# EAGLE design Parallel CS V3 (EAGLE 7.2.0)

## Sheet 1 of 2: Input Layer
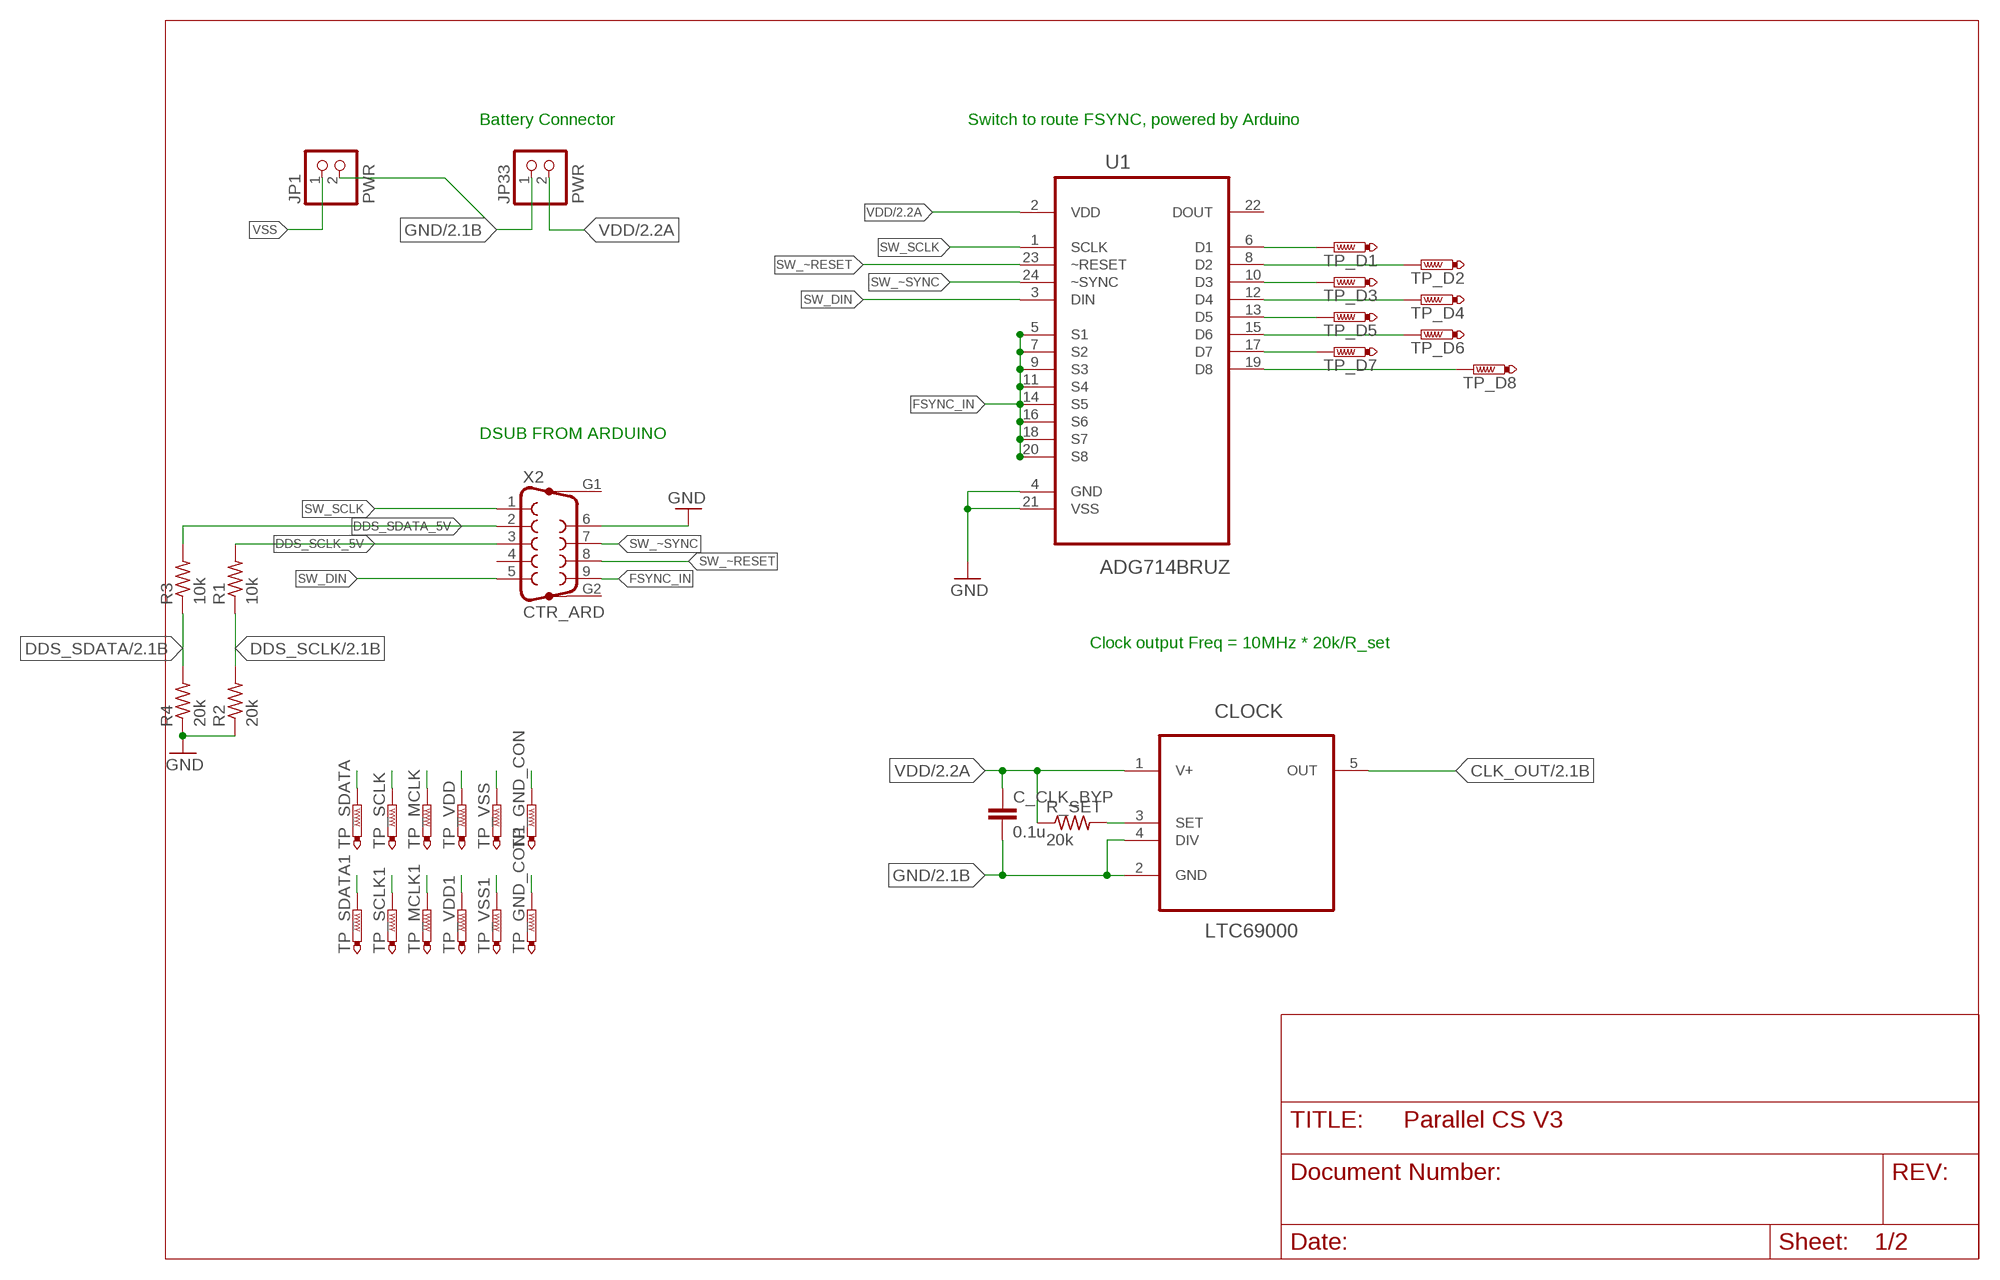
[diagram p0: schematic, sheet 1]

### Parts
C_CLK_BYP  0.1u  C-EUC0805  [C0805]
CLOCK  LTC69000  [SOT23-5L]
JP1  PWR  PINHD-1X2  [1X02]
JP33  PWR  PINHD-1X2  [1X02]
R1  10k  R-US_R0805  [R0805]
R2  20k  R-US_R0603  [R0603]
R3  10k  R-US_R0805  [R0805]
R4  20k  R-US_R0603  [R0603]
R_SET  20k  R-US_R0603  [R0603]
TP_D1  PTR1PAD1-13  [P1-13]
TP_D2  PTR1PAD1-13  [P1-13]
TP_D3  PTR1PAD1-13  [P1-13]
TP_D4  PTR1PAD1-13  [P1-13]
TP_D5  PTR1PAD1-13  [P1-13]
TP_D6  PTR1PAD1-13  [P1-13]
TP_D7  PTR1PAD1-13  [P1-13]
TP_D8  PTR1PAD1-13  [P1-13]
TP_GND_CON  PTR1PAD1-13  [P1-13]
TP_GND_CON1  PTR1PAD1-13  [P1-13]
TP_MCLK  PTR1PAD1-13  [P1-13]
TP_MCLK1  PTR1PAD1-13  [P1-13]
TP_SCLK  PTR1PAD1-13  [P1-13]
TP_SCLK1  PTR1PAD1-13  [P1-13]
TP_SDATA  PTR1PAD1-13  [P1-13]
TP_SDATA1  PTR1PAD1-13  [P1-13]
TP_VDD  PTR1PAD1-13  [P1-13]
TP_VDD1  PTR1PAD1-13  [P1-13]
TP_VSS  PTR1PAD1-13  [P1-13]
TP_VSS1  PTR1PAD1-13  [P1-13]
U1  ADG714BRUZ  [SOP65P640X120-24N]
X2  CTR_ARD  F09HP  [F09HP]

### Nets
CLK_OUT: CLOCK.5(OUT) TP_MCLK1.TP TP_MCLK.TP ; also sheet 2
DDS_SCLK: R1.1 R2.2 TP_SCLK1.TP TP_SCLK.TP ; also sheet 2
DDS_SCLK_5V: R1.2 X2.3
DDS_SDATA: R3.1 R4.2 TP_SDATA1.TP TP_SDATA.TP ; also sheet 2
DDS_SDATA_5V: R3.2 X2.2
FSYNC_CS1: TP_D1.TP U1.6(D1)
FSYNC_CS2: TP_D2.TP U1.8(D2)
FSYNC_CS3: TP_D3.TP U1.10(D3)
FSYNC_CS4: TP_D4.TP U1.12(D4)
FSYNC_CS5: TP_D5.TP U1.13(D5)
FSYNC_CS6: TP_D6.TP U1.15(D6)
FSYNC_CS7: TP_D7.TP U1.17(D7)
FSYNC_CS8: TP_D8.TP U1.19(D8)
FSYNC_IN: U1.5(S1) U1.7(S2) U1.9(S3) U1.11(S4) U1.14(S5) U1.16(S6) U1.18(S7) U1.20(S8) X2.9
GND: C_CLK_BYP.2 CLOCK.2(GND) CLOCK.4(DIV) JP1.2 JP33.1 R2.1 R4.1 TP_GND_CON1.TP TP_GND_CON.TP U1.4(GND) U1.21(VSS) X2.6 ; also sheet 2
N$2: CLOCK.3(SET) R_SET.2
SW_DIN: U1.3(DIN) X2.5
SW_SCLK: U1.1(SCLK) X2.1
SW_~RESET: U1.23(~RESET) X2.8
SW_~SYNC: U1.24(~SYNC) X2.7
VDD: C_CLK_BYP.1 CLOCK.1(V+) JP33.2 R_SET.1 TP_VDD1.TP TP_VDD.TP U1.2(VDD) ; also sheet 2
VSS: JP1.1 TP_VSS1.TP TP_VSS.TP ; also sheet 2
Unconnected: U1.22(DOUT) X2.4 X2.G1 X2.G2

### Notes on the sheet
- Battery Connector | Switch to route FSYNC, powered by Arduino
- DSUB FROM ARDUINO
- Clock output Freq = 10MHz * 20k/R_set

## Sheet 2 of 2: Current Source Block
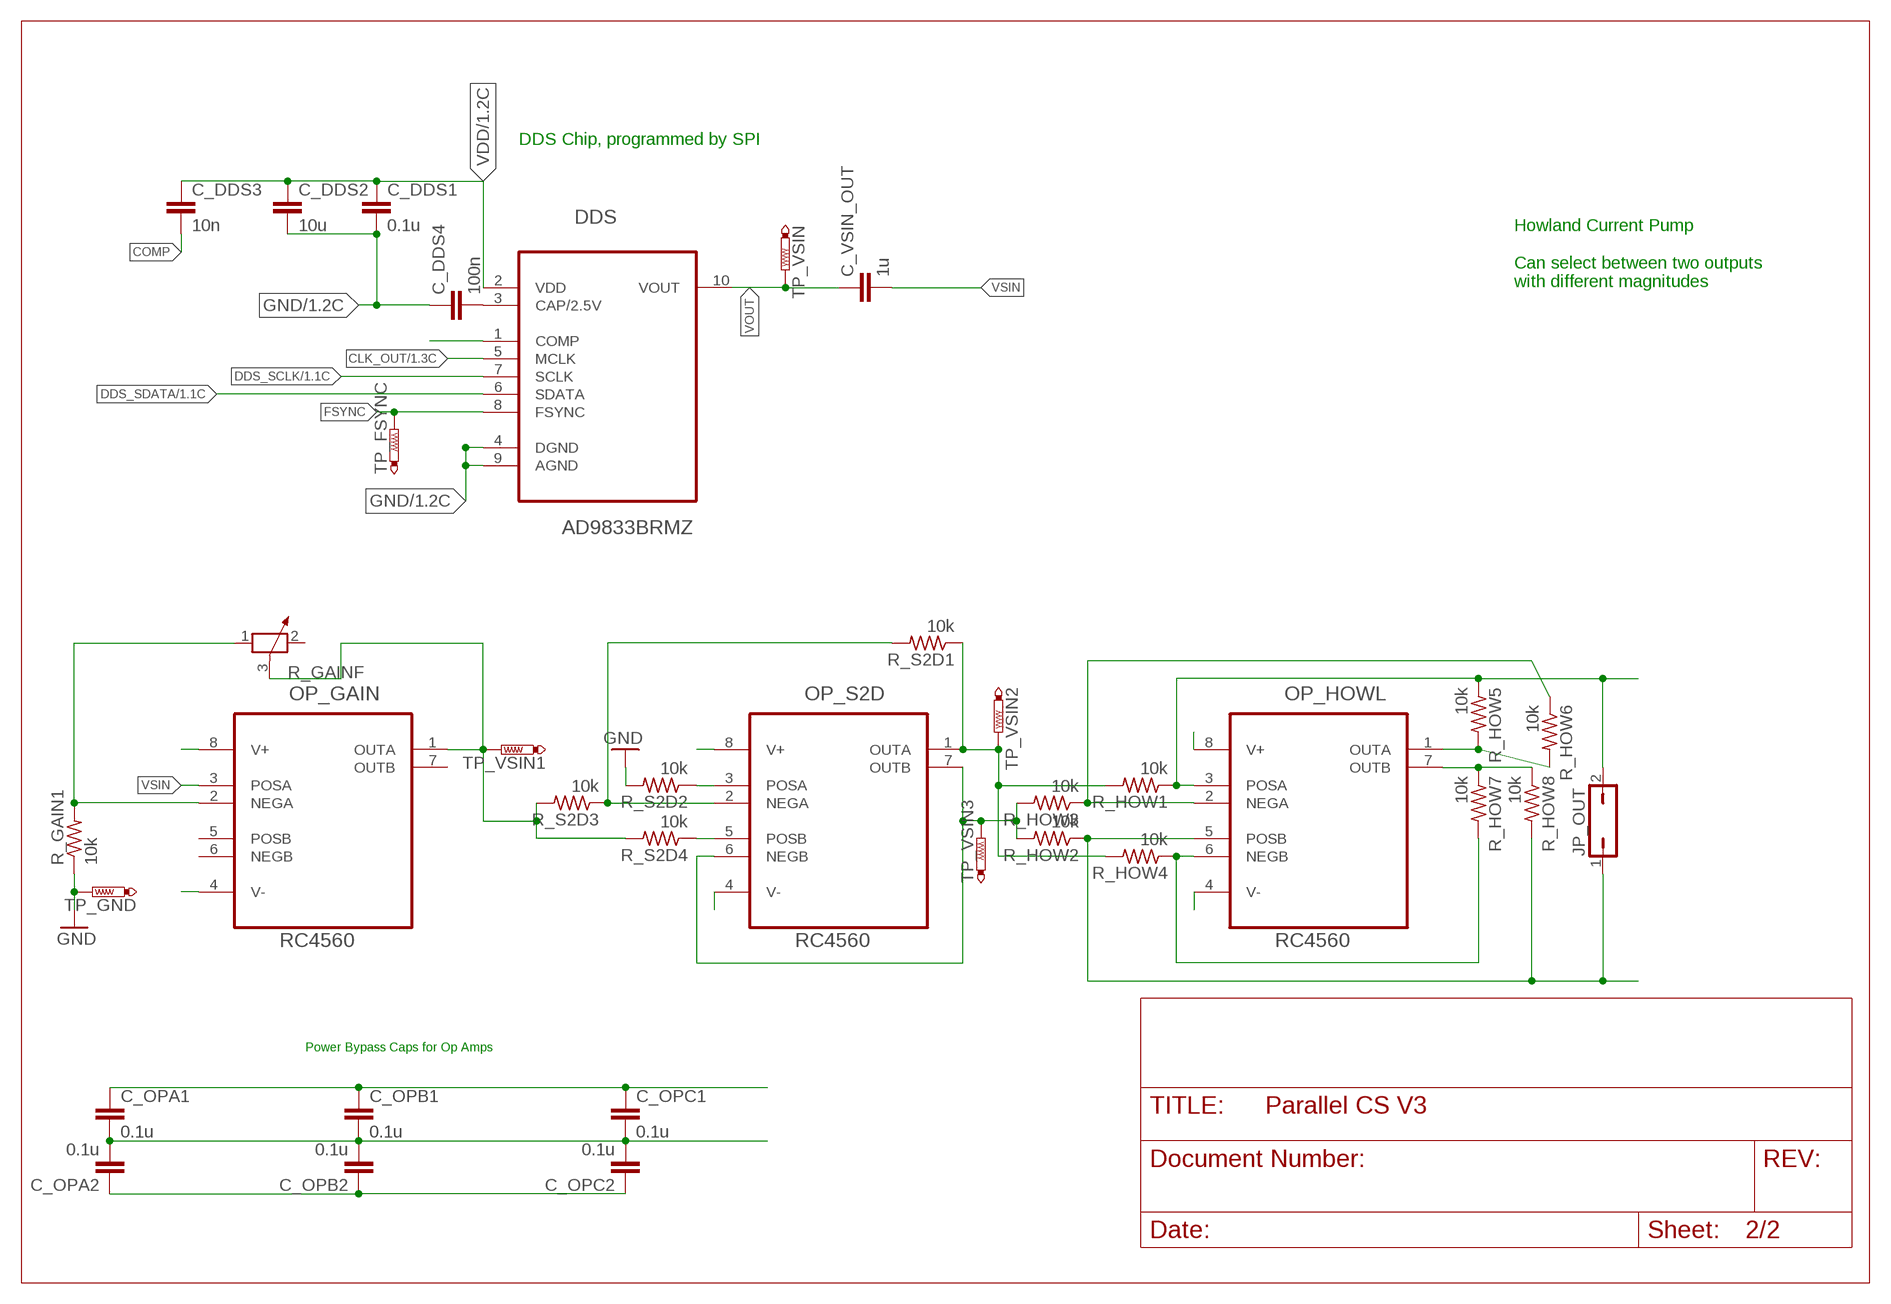
[diagram p1: schematic, sheet 2]

### Parts
C_DDS1  0.1u  C-EUC0805  [C0805]
C_DDS2  10u  C-EUC0805  [C0805]
C_DDS3  10n  C-EUC0805  [C0805]
C_DDS4  100n  C-EUC0805  [C0805]
C_OPA1  0.1u  C-EUC0805  [C0805]
C_OPA2  0.1u  C-EUC0805  [C0805]
C_OPB1  0.1u  C-EUC0805  [C0805]
C_OPB2  0.1u  C-EUC0805  [C0805]
C_OPC1  0.1u  C-EUC0805  [C0805]
C_OPC2  0.1u  C-EUC0805  [C0805]
C_VSIN_OUT  1u  C-EUC0805  [C0805]
DDS  AD9833BRMZ  [SOP50P490X110-10N]
JP_OUT  JP1Q  [JP1]
OP_GAIN  RC4560  [DIL08]
OP_HOWL  RC4560  [DIL08]
OP_S2D  RC4560  [DIL08]
R_GAIN1  10k  R-US_R0805  [R0805]
R_GAINF  POTENTIOMETER_PT-10  [PT-10]
R_HOW1  10k  R-US_R0805  [R0805]
R_HOW2  10k  R-US_R0805  [R0805]
R_HOW3  10k  R-US_R0805  [R0805]
R_HOW4  10k  R-US_R0805  [R0805]
R_HOW5  10k  R-US_R0805  [R0805]
R_HOW6  10k  R-US_R0805  [R0805]
R_HOW7  10k  R-US_R0805  [R0805]
R_HOW8  10k  R-US_R0805  [R0805]
R_S2D1  10k  R-US_R0805  [R0805]
R_S2D2  10k  R-US_R0805  [R0805]
R_S2D3  10k  R-US_R0805  [R0805]
R_S2D4  10k  R-US_R0805  [R0805]
TP_FSYNC  PTR1PAD1-13  [P1-13]
TP_GND  PTR1PAD1-13  [P1-13]
TP_VSIN  PTR1PAD1-13  [P1-13]
TP_VSIN1  PTR1PAD1-13  [P1-13]
TP_VSIN2  PTR1PAD1-13  [P1-13]
TP_VSIN3  PTR1PAD1-13  [P1-13]

### Nets
CLK_OUT: DDS.5(MCLK) ; also sheet 1
COMP: C_DDS3.2 DDS.1(COMP)
DDS_SCLK: DDS.7(SCLK) ; also sheet 1
DDS_SDATA: DDS.6(SDATA) ; also sheet 1
FSYNC: DDS.8(FSYNC) TP_FSYNC.TP
GND: C_DDS1.2 C_DDS2.2 C_DDS4.1 C_OPA1.2 C_OPA2.2 C_OPB1.2 C_OPB2.2 C_OPC1.2 C_OPC2.2 DDS.4(DGND) DDS.9(AGND) R_GAIN1.1 R_S2D2.2 TP_GND.TP ; also sheet 1
N$1: C_DDS4.2 DDS.3(CAP/2.5V)
N$3: OP_GAIN.1(OUTA) R_GAINF.3 R_S2D3.2 R_S2D4.2 TP_VSIN1.TP
N$4: OP_S2D.6(NEGB) OP_S2D.7(OUTB) R_HOW2.2 R_HOW3.2 TP_VSIN3.TP
N$5: OP_GAIN.2(NEGA) R_GAIN1.2 R_GAINF.1
N$6: OP_S2D.5(POSB) R_S2D4.1
N$8: OP_S2D.1(OUTA) R_HOW1.2 R_HOW4.2 R_S2D1.1 TP_VSIN2.TP
N$9: OP_S2D.3(POSA) R_S2D2.1
N$10: OP_S2D.2(NEGA) R_S2D1.2 R_S2D3.1
N$12: OP_HOWL.2(NEGA) R_HOW3.1 R_HOW6.1
N$13: JP_OUT.2 OP_HOWL.3(POSA) R_HOW1.1 R_HOW5.1
N$14: JP_OUT.1 OP_HOWL.5(POSB) R_HOW2.1 R_HOW8.2
N$16: OP_HOWL.1(OUTA) R_HOW5.2 R_HOW6.2
N$17: OP_HOWL.7(OUTB) R_HOW7.1 R_HOW8.1
N$20: OP_HOWL.6(NEGB) R_HOW4.1 R_HOW7.2
VDD: C_DDS1.1 C_DDS2.1 C_DDS3.1 C_OPA1.1 C_OPB1.1 C_OPC1.1 DDS.2(VDD) OP_GAIN.8(V+) OP_HOWL.8(V+) OP_S2D.8(V+) ; also sheet 1
VOUT: C_VSIN_OUT.1 DDS.10(VOUT) TP_VSIN.TP
VSIN: C_VSIN_OUT.2 OP_GAIN.3(POSA)
VSS: C_OPA2.1 C_OPB2.1 C_OPC2.1 OP_GAIN.4(V-) OP_HOWL.4(V-) OP_S2D.4(V-) ; also sheet 1
Unconnected: OP_GAIN.5(POSB) OP_GAIN.6(NEGB) OP_GAIN.7(OUTB) R_GAINF.2

### Notes on the sheet
- DDS Chip, programmed by SPI
- Howland Current Pump
  
  Can select between two outputs
  with different magnitudes
- Power Bypass Caps for Op Amps

## Library data of the parts
C_CLK_BYP C_DDS1-C_DDS4 C_OPA1 C_OPA2 C_OPB1 C_OPB2 C_OPC1 C_OPC2 C_VSIN_OUT = resistor:C-EU: CAPACITOR, European symbol
CLOCK = LTC6900:LTC69000: Low Power, 1kHz to 20MHz Resistor Set SOT-23 Oscillator
DDS = ad9833:AD9833BRMZ: Low Power 12.65 mW, 2.3 V to 5.5 V,Low Power 12.65 mW, 2.3 V to 5.5 V,Low Power 12.65 mW, 2.3 V to 5.5 V,Programmable Waveform Generator; MPN: AD9833BRMZ; OC_FARNELL: 1581966; OC_NEWARK: 19M1014; PACKAGE: MSOP-10; SUPPLIER: Analog Devices
JP1 JP33 = pinhead:PINHD-1X2: PIN HEADER
JP_OUT = jumper:JP1Q: JUMPER
OP_GAIN OP_HOWL OP_S2D = RC4560:RC4560: RC4560 Op-Amp Texas Instruments
R1-R4 R_SET = resistor:R-US_: RESISTOR, American symbol
R_GAIN1 R_HOW1-R_HOW8 R_S2D1-R_S2D4 = rcl:R-US_: RESISTOR, American symbol
R_GAINF = rcl:POTENTIOMETER_: Potentiometer
TP_D1-TP_D8 TP_FSYNC TP_GND TP_GND_CON TP_GND_CON1 TP_MCLK TP_MCLK1 TP_SCLK TP_SCLK1 TP_SDATA TP_SDATA1 TP_VDD TP_VDD1 TP_VSIN TP_VSIN1-TP_VSIN3 TP_VSS TP_VSS1 = testpad:PTR1: TEST PIN
U1 = SwitchBoard:ADG714BRUZ: CMOS, Low Voltage Serially Controlled, Octal SPST Switches; MPN: ADG714BRUZ; OC_FARNELL: 9604367; OC_NEWARK: 59K1531; PACKAGE: TSSOP-24; SUPPLIER: Analog Devices
X2 = con-subd:F09HP: SUB-D; OC_FARNELL: unknown; OC_NEWARK: unknown

## Board
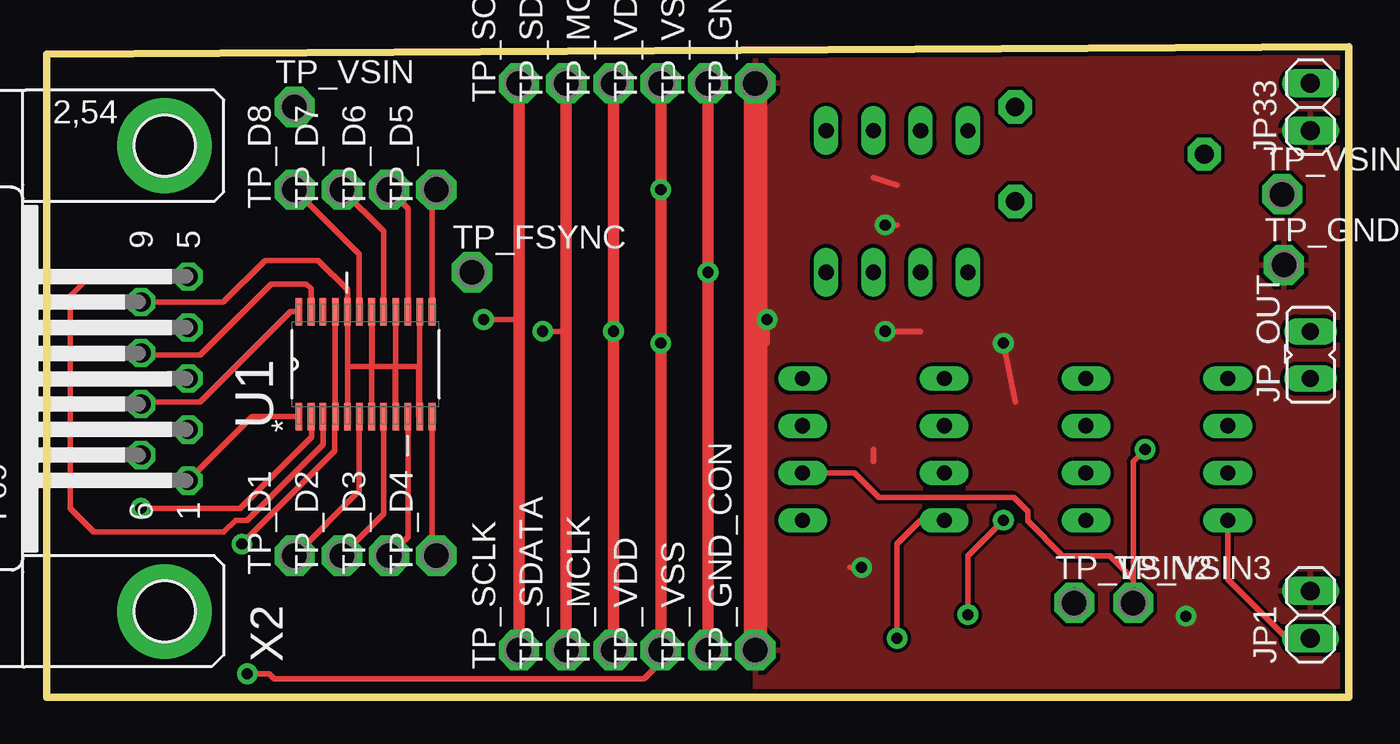
[diagram p2: board, top side]
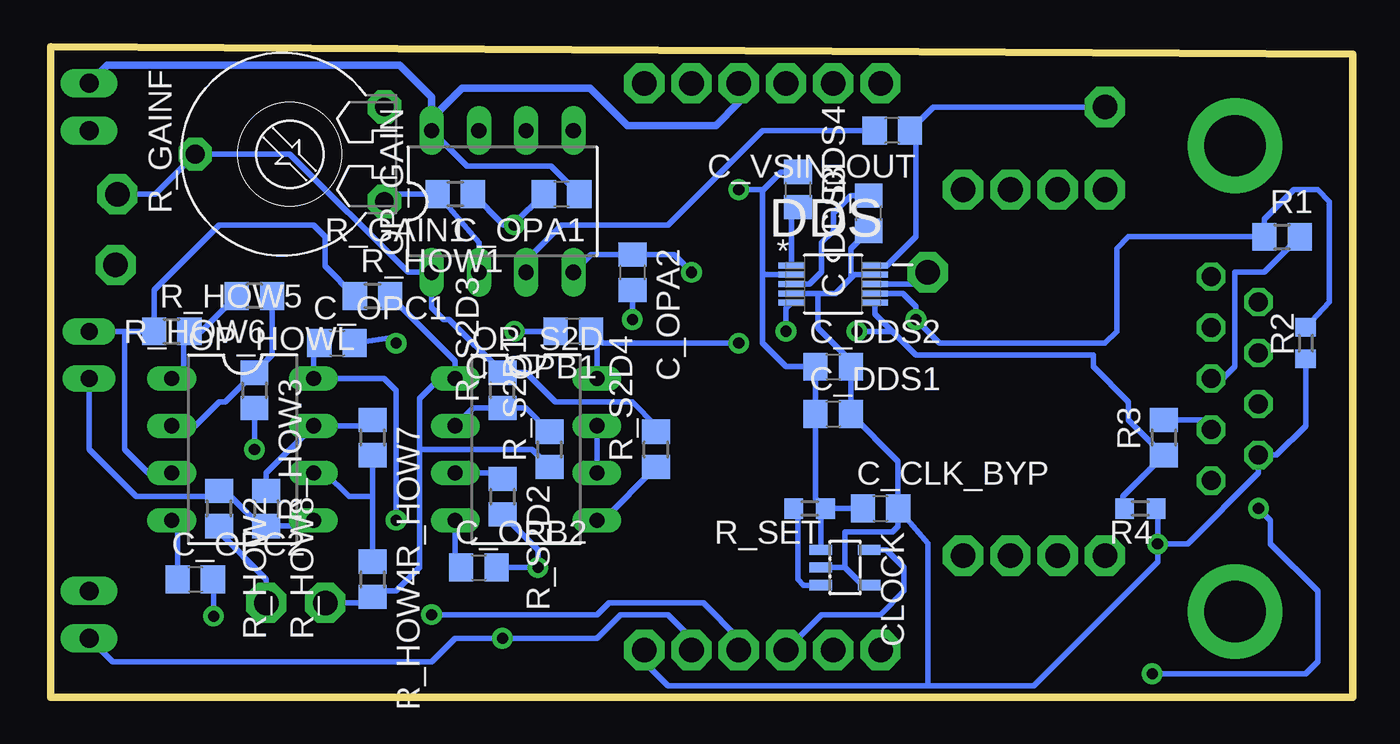
[diagram p3: board, bottom side, seen from below]

Size 70 x 35 mm. Coordinates in mm from the lower left corner, seen from the top.
Outline: 0,0 70,0 70,35 0,34.59 0,0
Copper layers (1*16): Top 0.035mm / dielectric 1.5mm / Bottom 0.035mm
Design rules "pcbtrain": minimum track width 0.2mm, minimum drill 0.4mm, track to track 0.2mm, track to pad 0.2mm, pad to pad 0.2mm, via to via 0.2mm, smd to smd 0mil, copper to edge 10mil, drill to drill 0.2mm, minimum pad ring 10mil, minimum via ring 10mil, stop-mask expansion 0.125mm, vias tented up to drill 0mil, thermal gap 10mil

### Footprints (pad centres in the part's own frame; a part is rotated, then mirrored left to right if it is on the bottom)
C0805 = smd 1.3 x 1.5: 1 -0.95,0; 2 0.95,0
SOT23-5L = smd 0.55 x 1.2: 1 -0.95,-1.3; 2 0,-1.3; 3 0.95,-1.3; 4 0.95,1.3; 5 -0.95,1.3
SOP50P490X110-10N = smd 1.422 x 0.305: 1 -2.235,0.991; 2 -2.235,0.508; 3 -2.235,0; 4 -2.235,-0.508; 5 -2.235,-0.991; 6 2.235,-0.991; 7 2.235,-0.508; 8 2.235,0; 9 2.235,0.508; 10 2.235,0.991
1X02 = drill 1.016 long: 1 -1.27,0; 2 1.27,0
JP1 = drill 0.914 long: 1 0,-1.27; 2 0,1.27
DIL08 = drill 0.813 long: 1 -3.81,-3.81; 2 -1.27,-3.81; 3 1.27,-3.81; 4 3.81,-3.81; 5 3.81,3.81; 6 1.27,3.81; 7 -1.27,3.81; 8 -3.81,3.81
R0805 = smd 1.3 x 1.5: 1 -0.95,0; 2 0.95,0
R0603 = smd 1 x 1.1: 1 -0.85,0; 2 0.85,0
PT-10 = drill 1.016 pad 1.778 octagon: 1 -2.54,-5.08; 2 2.54,-5.08; 3 0,5.08
P1-13 = drill 1.321 pad 2.159 octagon: TP 0,0
SOP65P640X120-24N = smd 1.473 x 0.356: 1 -2.819,3.581; 2 -2.819,2.921; 3 -2.819,2.286; 4 -2.819,1.626; 5 -2.819,0.965; 6 -2.819,0.33; 7 -2.819,-0.33; 8 -2.819,-0.965; 9 -2.819,-1.626; 10 -2.819,-2.286; 11 -2.819,-2.921; 12 -2.819,-3.581; 13 2.819,-3.581; 14 2.819,-2.921; 15 2.819,-2.286; 16 2.819,-1.626; 17 2.819,-0.965; 18 2.819,-0.33; 19 2.819,0.33; 20 2.819,0.965; 21 2.819,1.626; 22 2.819,2.286; 23 2.819,2.921; 24 2.819,3.581
F09HP = drill 1.016 octagon: 1 -5.486,-1.27; 2 -2.743,-1.27; 3 0,-1.27; 4 2.743,-1.27; 5 5.486,-1.27; 6 -4.115,1.27; 7 -1.372,1.27; 8 1.372,1.27; 9 4.115,1.27 | drill 3.302 pad 5.08: G1 -12.522,0; G2 12.522,0

### Placement (x,y rotation side)
C_CLK_BYP  25.4,10.16 0 bottom
C_DDS1  27.94,15.24 0 bottom
C_DDS2  27.94,17.78 0 bottom
C_DDS3  29.84,27.3 270 bottom
C_DDS4  26.04,26.04 90 bottom
C_OPA1  42.55,27.05 180 bottom
C_OPA2  38.73,22.86 270 bottom
C_OPB1  41.91,19.68 180 bottom
C_OPB2  46.99,6.99 0 bottom
C_OPC1  54.61,19.05 0 bottom
C_OPC2  62.23,6.35 0 bottom
C_VSIN_OUT  24.77,30.48 180 bottom
CLOCK  27.3,6.99 270 bottom
DDS  27.94,22.23 0 bottom
JP1  67.94,4.45 90 top
JP33  67.94,31.75 90 top
JP_OUT  67.94,18.41 0 top
OP_GAIN  45.72,26.67 0 bottom
OP_HOWL  59.69,13.34 270 bottom
OP_S2D  44.45,13.34 270 bottom
R1  3.81,24.77 0 bottom
R2  2.54,19.05 90 bottom
R3  10.16,13.97 90 bottom
R4  11.43,10.16 180 bottom
R_GAIN1  48.26,27.05 180 bottom
R_GAINF  57.15,29.21 90 bottom
R_HOW1  52.7,21.59 0 bottom
R_HOW2  60.96,10.16 270 bottom
R_HOW3  59.05,16.51 270 bottom
R_HOW4  52.7,6.35 270 bottom
R_HOW5  63.5,19.68 0 bottom
R_HOW6  59.05,21.59 180 bottom
R_HOW7  52.7,13.97 270 bottom
R_HOW8  58.42,10.16 270 bottom
R_S2D1  43.18,13.34 90 bottom
R_S2D2  45.72,10.79 270 bottom
R_S2D3  45.72,16.51 90 bottom
R_S2D4  37.47,13.34 90 bottom
R_SET  29.21,10.16 180 bottom
TP_D1  13.34,7.62 90 top
TP_D2  15.88,7.62 90 top
TP_D3  18.41,7.62 90 top
TP_D4  20.95,7.62 90 top
TP_D5  20.95,27.3 90 top
TP_D6  18.41,27.3 90 top
TP_D7  15.88,27.3 90 top
TP_D8  13.34,27.3 90 top
TP_FSYNC  22.86,22.86 0 top
TP_GND  66.52,23.25 0 top
TP_GND_CON  38.1,2.54 90 top
TP_GND_CON1  38.1,33.02 90 top
TP_MCLK  30.48,2.54 90 top
TP_MCLK1  30.48,33.02 90 top
TP_SCLK  25.4,2.54 90 top
TP_SCLK1  25.4,33.02 90 top
TP_SDATA  27.94,2.54 90 top
TP_SDATA1  27.94,33.02 90 top
TP_VDD  33.02,2.54 90 top
TP_VDD1  33.02,33.02 90 top
TP_VSIN  13.34,31.75 0 top
TP_VSIN1  66.42,27.05 0 top
TP_VSIN2  55.24,5.08 0 top
TP_VSIN3  58.42,5.08 0 top
TP_VSS  35.56,2.54 90 top
TP_VSS1  35.56,33.02 90 top
U1  17.14,17.91 90 top
X2  6.35,17.14 90 top

### Tracks (layer width: path | path; a pad name or v marks a point on that pad's centre or on a via)
CLK_OUT  (via drill 0.6)
  Top 0.61: TP_MCLK1.TP v30.48,19.68 TP_MCLK.TP
  Bottom 0.305: DDS.5 30.48,20.93 v30.48,19.68 | TP_MCLK.TP 28.57,4.45 25.4,4.45 24.13,5.71 24.13,6.99 25.08,7.93 CLOCK.5
COMP
  Bottom 0.305: C_DDS3.2 30.18,26.02 DDS.1
DDS_SCLK  (via drill 0.6)
  Top 0.305: v23.5,20.32 25.4,20.32
  Top 0.61: TP_SCLK1.TP 25.4,20.32 TP_SCLK.TP
  Bottom 0.305: DDS.7 24.2,21.72 23.5,21.01 v23.5,20.32 22.23,19.05 13.34,19.05 12.7,19.68 12.7,24.13 12.06,24.77 R1.1 4.76,25.72 3.17,27.3 1.91,27.3 1.27,26.67 1.27,21.27 R2.2
DDS_SCLK_5V
  Bottom 0.305: R1.2 4.76,22.86 6.35,22.86 6.35,17.78 6.99,17.14 X2.3
DDS_SDATA  (via drill 0.6)
  Top 0.305: v26.67,19.68 27.94,19.68
  Top 0.61: TP_SDATA.TP 27.94,19.68 TP_SDATA1.TP
  Bottom 0.305: 24.77,19.68 v26.67,19.68 | 24.77,19.68 25.7,20.62 DDS.6 | R4.2 12.38,10.8 R3.1 12.06,14.93 12.06,15.88 13.97,17.78 13.97,18.41 23.5,18.41 24.77,19.68
DDS_SDATA_5V
  Bottom 0.305: 9.64,14.4 R3.2 8.14,14.92 X2.2
FSYNC
  Bottom 0.305: TP_FSYNC.TP 23.5,22.23 DDS.8
FSYNC_CS1
  Top 0.305: TP_D1.TP 16.82,11.1 U1.6
FSYNC_CS2
  Top 0.305: TP_D2.TP 18.11,9.86 U1.8
FSYNC_CS3
  Top 0.305: TP_D3.TP 19.43,8.64 U1.10
FSYNC_CS4
  Top 0.305: TP_D4.TP 20.73,7.85 U1.12
FSYNC_CS5
  Top 0.305: TP_D5.TP 20.73,27.08 U1.13
FSYNC_CS6
  Top 0.305: TP_D6.TP 19.43,26.29 U1.15
FSYNC_CS7
  Top 0.305: TP_D7.TP 18.11,25.07 U1.17
FSYNC_CS8
  Top 0.305: TP_D8.TP 16.82,23.82 U1.19
FSYNC_IN
  Top 0.305: X2.9 9.5,21.25 11.74,23.5 14.61,23.5 16.18,21.92 U1.20 16.18,17.78 | U1.5 16.18,17.78 | U1.7 U1.18 17.5,20.71 17.5,17.78 | U1.16 U1.9 18.75,15.12 18.75,17.78 | U1.14 U1.11 20,15.16 20,17.75 19.97,17.78 18.75,17.78 | 18.75,17.78 17.5,17.78 | 17.5,17.78 16.18,17.78
GND  (via drill 0.6)
  Top 0.305: U1.21 U1.4 15.5,15.08 15.5,13.25 v10.5,8.25 | v38.73,20.32 38.73,19.05 | 45.72,27.55 44.45,27.94 | v45.09,25.4 45.72,25.4 | 44.45,12.7 44.45,13.34 | v45.09,19.68 46.99,19.68 | v43.81,6.99 43.18,6.99 | v51.44,19.05 52.07,15.88 | v61.25,4.37 61.25,4.25
  Top 1.27: TP_GND_CON.TP TP_GND_CON1.TP
  Bottom 0.305: v10.5,8.25 v10.5,8.26 8.89,8.26 5.08,12.06 X2.6 4.12,13.03 2.54,14.61 R2.1 | 26.99,22.54 26.8,22.73 DDS.9 | 26.99,22.54 27.81,21.72 28.75,21.72 | 28.75,21.72 DDS.4 | 22.86,0.64 36.83,0.64 38.1,1.91 TP_GND_CON.TP | 22.86,0.64 17.14,0.64 10.5,7.28 v10.5,8.25 | C_DDS4.1 26.99,24.13 26.99,22.54 | CLOCK.2 27.3,6.99 | 27.3,6.99 26.36,6.04 CLOCK.4 | 27.3,6.99 27.3,8.89 24.77,8.89 24.45,9.21 C_CLK_BYP.2 | C_CLK_BYP.2 22.86,8.27 22.86,0.64 | 28.75,21.72 28.75,19.86 27.3,18.41 27.3,17.78 C_DDS2.2 C_DDS1.2 24.45,12.7 C_CLK_BYP.2 | C_OPA2.2 v38.73,20.32 | C_OPA1.2 45.09,25.46 v45.09,25.4 45.66,25.4 R_GAIN1.1 | R4.1 10.5,10.14 v10.5,8.25 | C_OPB1.2 v45.09,19.68 | 45.72,7.3 C_OPB2.2 v43.81,6.99 43.81,7.94 R_S2D2.2 | C_OPC1.2 51.44,19.36 v51.44,19.05 | C_OPC2.2 61.25,6.32 v61.25,4.37
  pour Top: 38.1,35.56 71.75,36.2 71.75,-0.64 38.1,-1.27
N$1
  Bottom 0.305: DDS.3 29.21,22.23 28.57,22.86 28.57,24.45 27.94,25.08 27.94,26.04 26.99,26.98 C_DDS4.2
N$2
  Bottom 0.305: R_SET.2 29.84,9.95 29.84,6.35 29.53,6.04 CLOCK.3
N$3
  Bottom 0.305: OP_GAIN.1 50.8,22.86 57.15,29.21 R_GAINF.3 64.39,27.05 TP_VSIN1.TP | 49.53,22.54 OP_GAIN.1 | R_S2D4.2 37.47,14.61 38.73,15.88 42.87,15.88 44.45,17.46 R_S2D3.2 48.58,20.32 48.9,20.32 49.53,20.95 OP_GAIN.1
N$4  (via drill 0.6)
  Top 0.305: OP_S2D.6 43.44,12.06 44.75,10.75 52,10.75 52.75,10 52.75,9.48 54.61,7.62 57.15,7.62 58.42,6.35 | 58.42,6.35 58.42,5.71 TP_VSIN3.TP | v59.05,13.34 58.42,12.7 58.42,6.35
  Bottom 0.305: OP_S2D.6 OP_S2D.7 | R_HOW2.2 60.96,8.89 58.42,6.35 TP_VSIN3.TP | R_HOW3.2 v59.05,13.34
N$5
  Bottom 0.305: OP_GAIN.2 46.99,24.45 R_GAIN1.2 51.69,27.05 R_GAINF.1
N$6
  Bottom 0.305: R_S2D4.1 40.33,9.53 OP_S2D.5
N$8
  Bottom 0.305: R_S2D1.1 44.13,13.34 50.16,13.34 | R_HOW1.2 48.26,18.09 OP_S2D.1 49.1,17.14 50.16,16.09 50.16,13.34 | 50.16,13.34 50.16,6.99 51.44,5.71 52.39,5.71 R_HOW4.2 53.02,5.08 TP_VSIN2.TP
N$9
  Bottom 0.305: R_S2D2.1 46.04,12.06 OP_S2D.3
N$10
  Bottom 0.305: OP_S2D.2 47.3,15.56 R_S2D3.1 44.45,15.56 R_S2D1.2
N$12
  Bottom 0.305: OP_HOWL.2 62.23,14.61 60.96,15.88 60.64,15.88 R_HOW3.1 58.1,18.41 R_HOW6.1
N$13
  Bottom 0.305: 66.04,19.68 JP_OUT.2 | OP_HOWL.3 64.77,12.06 66.04,13.34 66.04,19.68 | 66.04,19.68 R_HOW5.1 64.45,21.91 60.96,25.4 55.88,25.4 55.24,24.77 55.24,23.18 R_HOW1.1
N$14
  Bottom 0.305: OP_HOWL.5 56.2,9.21 R_HOW8.2 58.73,9.53 59.05,9.53 60.64,11.11 R_HOW2.1 61.27,10.79 65.41,10.79 67.94,13.34 JP_OUT.1
N$16
  Bottom 0.305: OP_HOWL.1 62.87,17.14 62.87,19.37 R_HOW5.2 61.91,19.68 R_HOW6.2
N$17
  Bottom 0.305: R_HOW7.1 53.02,14.61 OP_HOWL.7 58.42,12.06 R_HOW8.1
N$20
  Bottom 0.305: R_HOW4.1 52.7,10.79 | 52.7,10.79 R_HOW7.2 | 52.7,10.79 53.98,10.79 55.24,12.06 OP_HOWL.6
SW_DIN
  Top 0.305: X2.5 7.39,22.86 2.54,22.86 1.27,21.59 1.27,10.16 2.54,8.89 9.53,8.89 10.16,9.53 10.79,9.53 14.86,13.59 U1.3
SW_SCLK
  Top 0.305: X2.1 11.06,15.1 U1.1
SW_~RESET
  Top 0.305: X2.8 5.18,18.41 8.26,18.41 12.06,22.23 13.97,22.23 14.22,21.97 U1.23
SW_~SYNC
  Top 0.305: X2.7 5.18,15.88 8.26,15.88 13.11,20.73 U1.24
VDD  (via drill 0.6)
  Top 0.305: v5.08,10.16 10.41,10.16 14.25,14 14.25,14.45 14.22,14.47 U1.2 | TP_VDD.TP 33.02,1.91 32.12,1 12.25,1 11.98,1.27 v10.79,1.27 | v51.44,9.53 49.53,7.62 v49.53,4.45
  Top 0.61: TP_VDD1.TP v33.02,27.3 v33.02,19.05 33.02,1.91
  Bottom 0.305: C_DDS3.1 30.75,28.25 31.75,27.25 | 31.75,22.86 31.75,19.05 30.48,17.78 C_DDS2.1 C_DDS1.1 28.89,10.69 R_SET.1 | 31.75,22.86 31.75,27.25 | C_CLK_BYP.1 R_SET.1 | R_SET.1 28.61,9.91 CLOCK.1 | 31.75,27.25 31.8,27.3 v33.02,27.3 | OP_GAIN.8 47.62,28.57 43.12,28.57 C_OPA1.1 | 31.75,22.86 31.62,22.73 DDS.2 | v5.08,10.16 4.45,9.53 4.45,8.26 1.91,5.71 1.91,1.91 2.54,1.27 v10.79,1.27 | 40.96,19.37 C_OPB1.1 | C_OPB1.1 40.64,19.36 OP_S2D.8 | v51.44,9.53 51.44,16.51 52.07,17.14 53.98,17.14 54.61,17.14 OP_HOWL.8 55.88,18.73 C_OPC1.1 | C_OPB1.1 40.33,19.05 v33.02,19.05 | TP_VDD.TP 33.02,3.17 34.92,5.08 40.01,5.08 40.64,4.45 v49.53,4.45
  Bottom 0.406: JP33.2 66.97,34 51.25,34 49.53,32.28 OP_GAIN.8 49.53,31.11 47.9,32.75 41,32.75 39,30.75 34.25,30.75 33.02,31.98 TP_VDD1.TP
VOUT
  Bottom 0.305: DDS.10 25.04,23.22 23.5,24.77 23.5,30.16 C_VSIN_OUT.1 22.55,31.75 TP_VSIN.TP
VSIN
  Bottom 0.305: C_VSIN_OUT.2 31.75,30.48 36.83,25.4 42.55,25.4 44.45,23.5 OP_GAIN.3
VSS  (via drill 0.6)
  Top 0.305: JP1.1 66.67,3.17 63.5,6.35 OP_HOWL.4 | OP_S2D.4 46.99,9.53 45.72,8.26 v45.72,3.17
  Top 0.406: 35.56,2.19 TP_VSS.TP
  Top 0.61: TP_VSS1.TP v35.56,22.86 TP_VSS.TP
  Bottom 0.305: v35.56,22.86 36.51,23.81 C_OPA2.1 40.96,23.81 OP_GAIN.4 | C_OPB2.1 48.26,7.3 OP_S2D.4 | OP_HOWL.4 63.18,9.21 C_OPC2.1 | JP1.1 66.67,1.91 49.53,1.91 48.26,3.17 46.99,3.17 v45.72,3.17 40.64,3.17 39.37,4.45 36.83,4.45 35.56,3.17 TP_VSS.TP